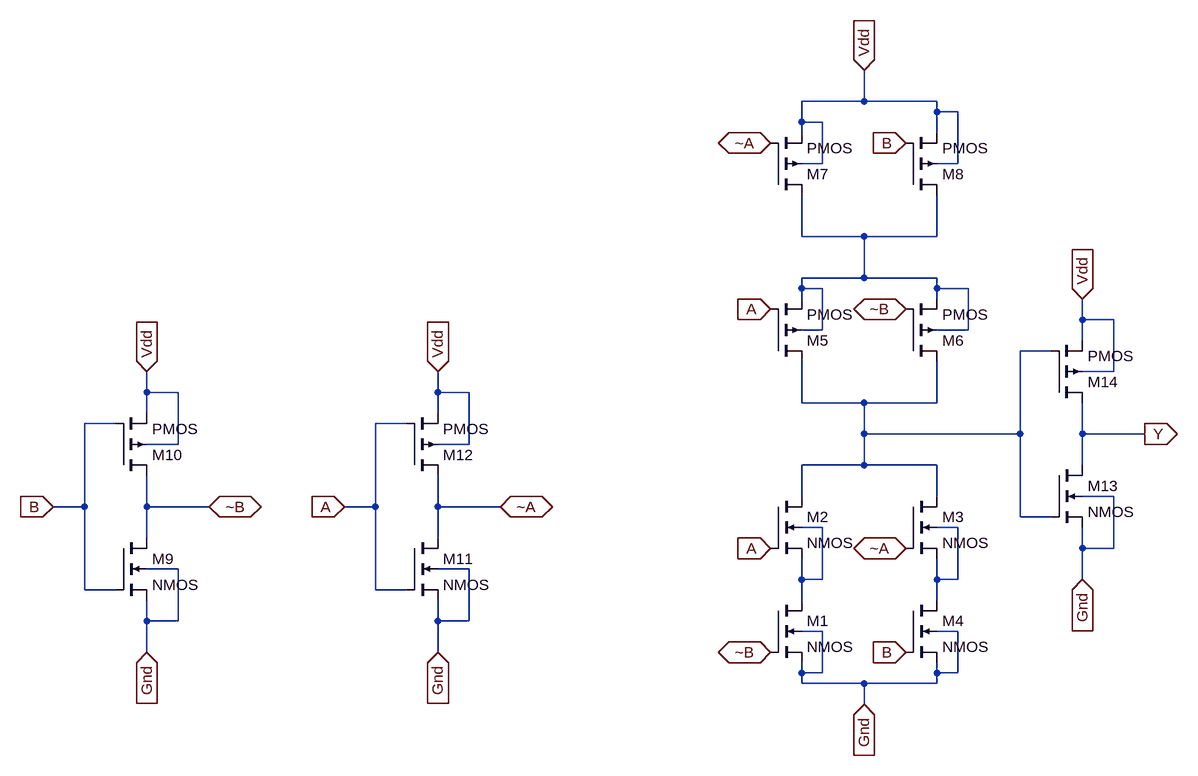
[diagram p0: schematic XOR1.asc]
XOR1.asc, the LTspice schematic file:
Version 4
SHEET 1 880 680
WIRE 288 -592 288 -640
WIRE 288 -592 192 -592
WIRE 400 -592 288 -592
WIRE 400 -576 400 -592
WIRE 432 -576 400 -576
WIRE 192 -560 192 -592
WIRE 224 -560 192 -560
WIRE 192 -544 192 -560
WIRE 400 -544 400 -576
WIRE 224 -496 224 -560
WIRE 224 -496 192 -496
WIRE 432 -496 432 -576
WIRE 432 -496 400 -496
WIRE 192 -384 192 -448
WIRE 288 -384 192 -384
WIRE 400 -384 400 -448
WIRE 400 -384 288 -384
WIRE 288 -320 288 -384
WIRE 288 -320 192 -320
WIRE 400 -320 288 -320
WIRE 192 -304 192 -320
WIRE 224 -304 192 -304
WIRE 400 -304 400 -320
WIRE 448 -304 400 -304
WIRE 192 -288 192 -304
WIRE 400 -288 400 -304
WIRE 624 -256 624 -288
WIRE 672 -256 624 -256
WIRE 224 -240 224 -304
WIRE 224 -240 192 -240
WIRE 448 -240 448 -304
WIRE 448 -240 400 -240
WIRE 624 -224 624 -256
WIRE 576 -208 528 -208
WIRE 672 -176 672 -256
WIRE 672 -176 624 -176
WIRE -816 -144 -816 -176
WIRE -768 -144 -816 -144
WIRE -368 -144 -368 -176
WIRE -320 -144 -368 -144
WIRE 192 -128 192 -192
WIRE 288 -128 192 -128
WIRE 400 -128 400 -192
WIRE 400 -128 288 -128
WIRE -816 -112 -816 -144
WIRE -368 -112 -368 -144
WIRE -864 -96 -912 -96
WIRE -416 -96 -464 -96
WIRE 288 -80 288 -128
WIRE 528 -80 528 -208
WIRE 528 -80 288 -80
WIRE 624 -80 624 -128
WIRE 720 -80 624 -80
WIRE -768 -64 -768 -144
WIRE -768 -64 -816 -64
WIRE -320 -64 -320 -144
WIRE -320 -64 -368 -64
WIRE 288 -32 288 -80
WIRE 288 -32 192 -32
WIRE 400 -32 288 -32
WIRE 624 -32 624 -80
WIRE 192 16 192 -32
WIRE 400 16 400 -32
WIRE 672 16 624 16
WIRE -912 32 -912 -96
WIRE -912 32 -960 32
WIRE -816 32 -816 -16
WIRE -720 32 -816 32
WIRE -464 32 -464 -96
WIRE -464 32 -512 32
WIRE -368 32 -368 -16
WIRE -272 32 -368 32
WIRE 528 48 528 -80
WIRE 576 48 528 48
WIRE 224 64 192 64
WIRE 432 64 400 64
WIRE -816 80 -816 32
WIRE -368 80 -368 32
WIRE 624 96 624 64
WIRE 672 96 672 16
WIRE 672 96 624 96
WIRE -768 128 -816 128
WIRE -320 128 -368 128
WIRE 192 144 192 112
WIRE 224 144 224 64
WIRE 224 144 192 144
WIRE 400 144 400 112
WIRE 432 144 432 64
WIRE 432 144 400 144
WIRE 624 144 624 96
WIRE -912 160 -912 32
WIRE -864 160 -912 160
WIRE -464 160 -464 32
WIRE -416 160 -464 160
WIRE 192 176 192 144
WIRE 400 176 400 144
WIRE -816 208 -816 176
WIRE -768 208 -768 128
WIRE -768 208 -816 208
WIRE -368 208 -368 176
WIRE -320 208 -320 128
WIRE -320 208 -368 208
WIRE 224 224 192 224
WIRE 432 224 400 224
WIRE -816 256 -816 208
WIRE -368 256 -368 208
WIRE 192 288 192 272
WIRE 224 288 224 224
WIRE 224 288 192 288
WIRE 400 288 400 272
WIRE 432 288 432 224
WIRE 432 288 400 288
WIRE 192 304 192 288
WIRE 288 304 192 304
WIRE 400 304 400 288
WIRE 400 304 288 304
WIRE 288 336 288 304
FLAG 288 -640 Vdd
IOPIN 288 -640 In
FLAG -816 -176 Vdd
IOPIN -816 -176 In
FLAG -960 32 B
IOPIN -960 32 In
FLAG -720 32 ~B
IOPIN -720 32 BiDir
FLAG -368 -176 Vdd
IOPIN -368 -176 In
FLAG -512 32 A
IOPIN -512 32 In
FLAG -272 32 ~A
IOPIN -272 32 BiDir
FLAG 144 96 A
IOPIN 144 96 In
FLAG 144 -272 A
IOPIN 144 -272 In
FLAG 144 256 ~B
IOPIN 144 256 BiDir
FLAG 352 -272 ~B
IOPIN 352 -272 BiDir
FLAG 352 96 ~A
IOPIN 352 96 BiDir
FLAG 352 256 B
IOPIN 352 256 In
FLAG 144 -528 ~A
IOPIN 144 -528 BiDir
FLAG 352 -528 B
IOPIN 352 -528 In
FLAG 624 -288 Vdd
IOPIN 624 -288 In
FLAG 720 -80 Y
IOPIN 720 -80 Out
FLAG -816 256 Gnd
IOPIN -816 256 In
FLAG -368 256 Gnd
IOPIN -368 256 In
FLAG 288 336 Gnd
IOPIN 288 336 In
FLAG 624 144 Gnd
IOPIN 624 144 In
SYMBOL nmos4 144 176 R0
SYMATTR InstName M1
SYMBOL nmos4 144 16 R0
SYMATTR InstName M2
SYMBOL nmos4 352 16 R0
SYMATTR InstName M3
SYMBOL nmos4 352 176 R0
SYMATTR InstName M4
SYMBOL pmos4 144 -192 M180
SYMATTR InstName M5
SYMBOL pmos4 352 -192 M180
SYMATTR InstName M6
SYMBOL pmos4 144 -448 M180
SYMATTR InstName M7
SYMBOL pmos4 352 -448 M180
SYMATTR InstName M8
SYMBOL nmos4 -864 80 R0
SYMATTR InstName M9
SYMBOL pmos4 -864 -16 M180
SYMATTR InstName M10
SYMBOL nmos4 -416 80 R0
SYMATTR InstName M11
SYMBOL pmos4 -416 -16 M180
SYMATTR InstName M12
SYMBOL nmos4 576 -32 R0
SYMATTR InstName M13
SYMBOL pmos4 576 -128 M180
SYMATTR InstName M14

The netlist it stands for:
* XOR1.asc
M1 N003 ~B Gnd Gnd NMOS
M2 N002 A N003 N003 NMOS
M3 N002 ~A N004 N004 NMOS
M4 N004 B Gnd Gnd NMOS
M5 N002 A N001 N001 PMOS
M6 N002 ~B N001 N001 PMOS
M7 N001 ~A Vdd Vdd PMOS
M8 N001 B Vdd Vdd PMOS
M9 ~B B Gnd Gnd NMOS
M10 ~B B Vdd Vdd PMOS
M11 ~A A Gnd Gnd NMOS
M12 ~A A Vdd Vdd PMOS
M13 Y N002 Gnd Gnd NMOS
M14 Y N002 Vdd Vdd PMOS
.model NMOS NMOS
.model PMOS PMOS
.lib standard.mos
.backanno
.end